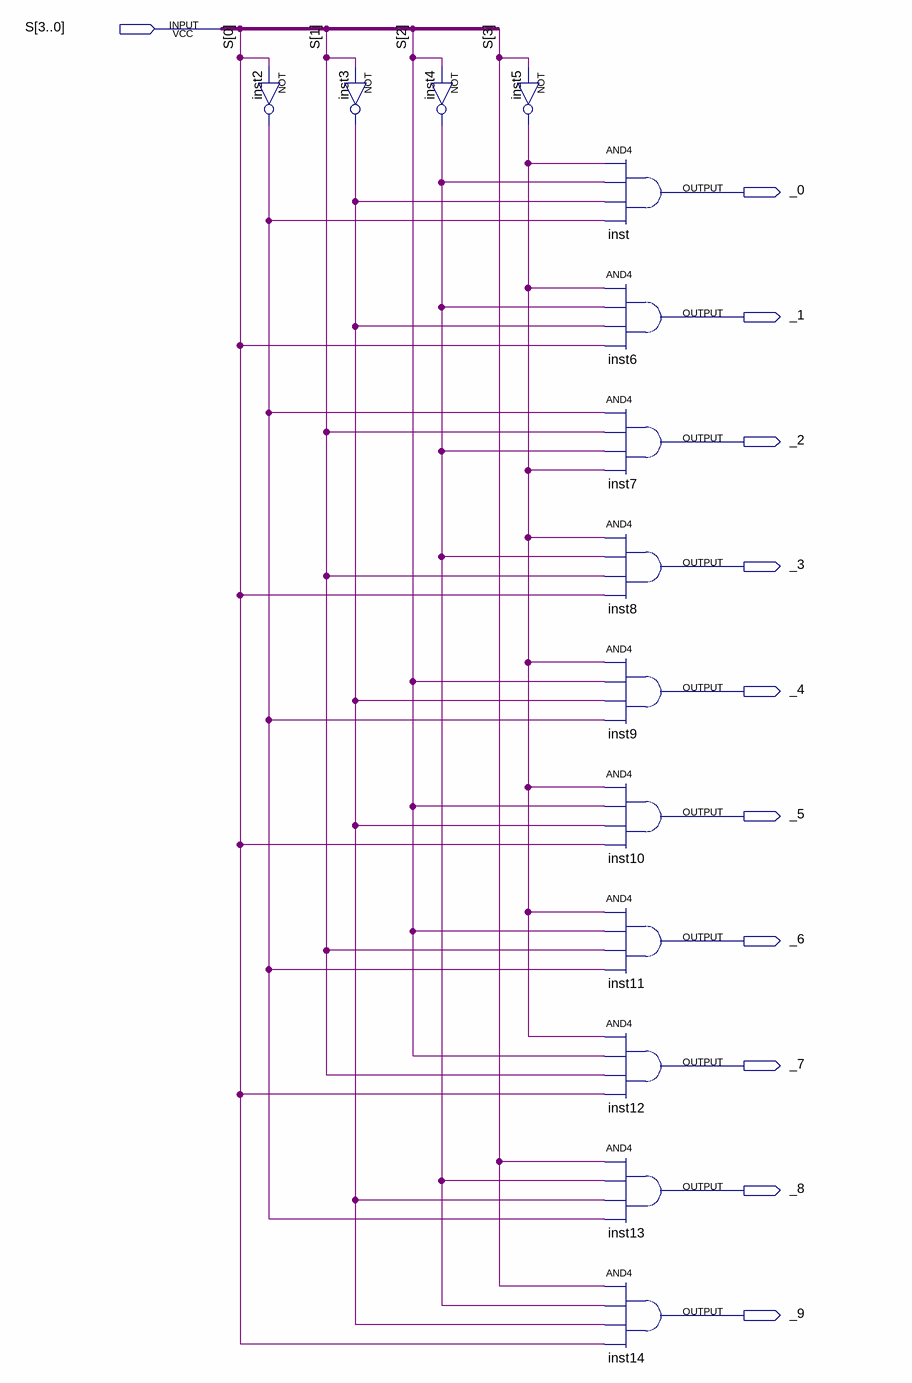
[diagram p0: schematic sheet]
// Quartus schematic BCD_decoder.bdf as structural Verilog: 14 symbols, 11 pins
module BCD_decoder (
  input  [3:0] S,
  output _0,
  output _1,
  output _2,
  output _3,
  output _4,
  output _5,
  output _6,
  output _7,
  output _8,
  output _9
);

  wire inst2_out, inst3_out, inst4_out, inst5_out;

  not inst2 (inst2_out, S[0]);
  not inst3 (inst3_out, S[1]);
  not inst4 (inst4_out, S[2]);
  not inst5 (inst5_out, S[3]);
  and inst (_0, inst5_out, inst4_out, inst3_out, inst2_out);
  and inst6 (_1, inst5_out, inst4_out, inst3_out, S[0]);
  and inst7 (_2, inst2_out, S[1], inst4_out, inst5_out);
  and inst8 (_3, inst5_out, inst4_out, S[1], S[0]);
  and inst9 (_4, inst5_out, S[2], inst3_out, inst2_out);
  and inst10 (_5, inst5_out, S[2], inst3_out, S[0]);
  and inst11 (_6, inst5_out, S[2], S[1], inst2_out);
  and inst12 (_7, inst5_out, S[2], S[1], S[0]);
  and inst13 (_8, S[3], inst4_out, inst3_out, inst2_out);
  and inst14 (_9, S[3], inst4_out, inst3_out, S[0]);
endmodule
